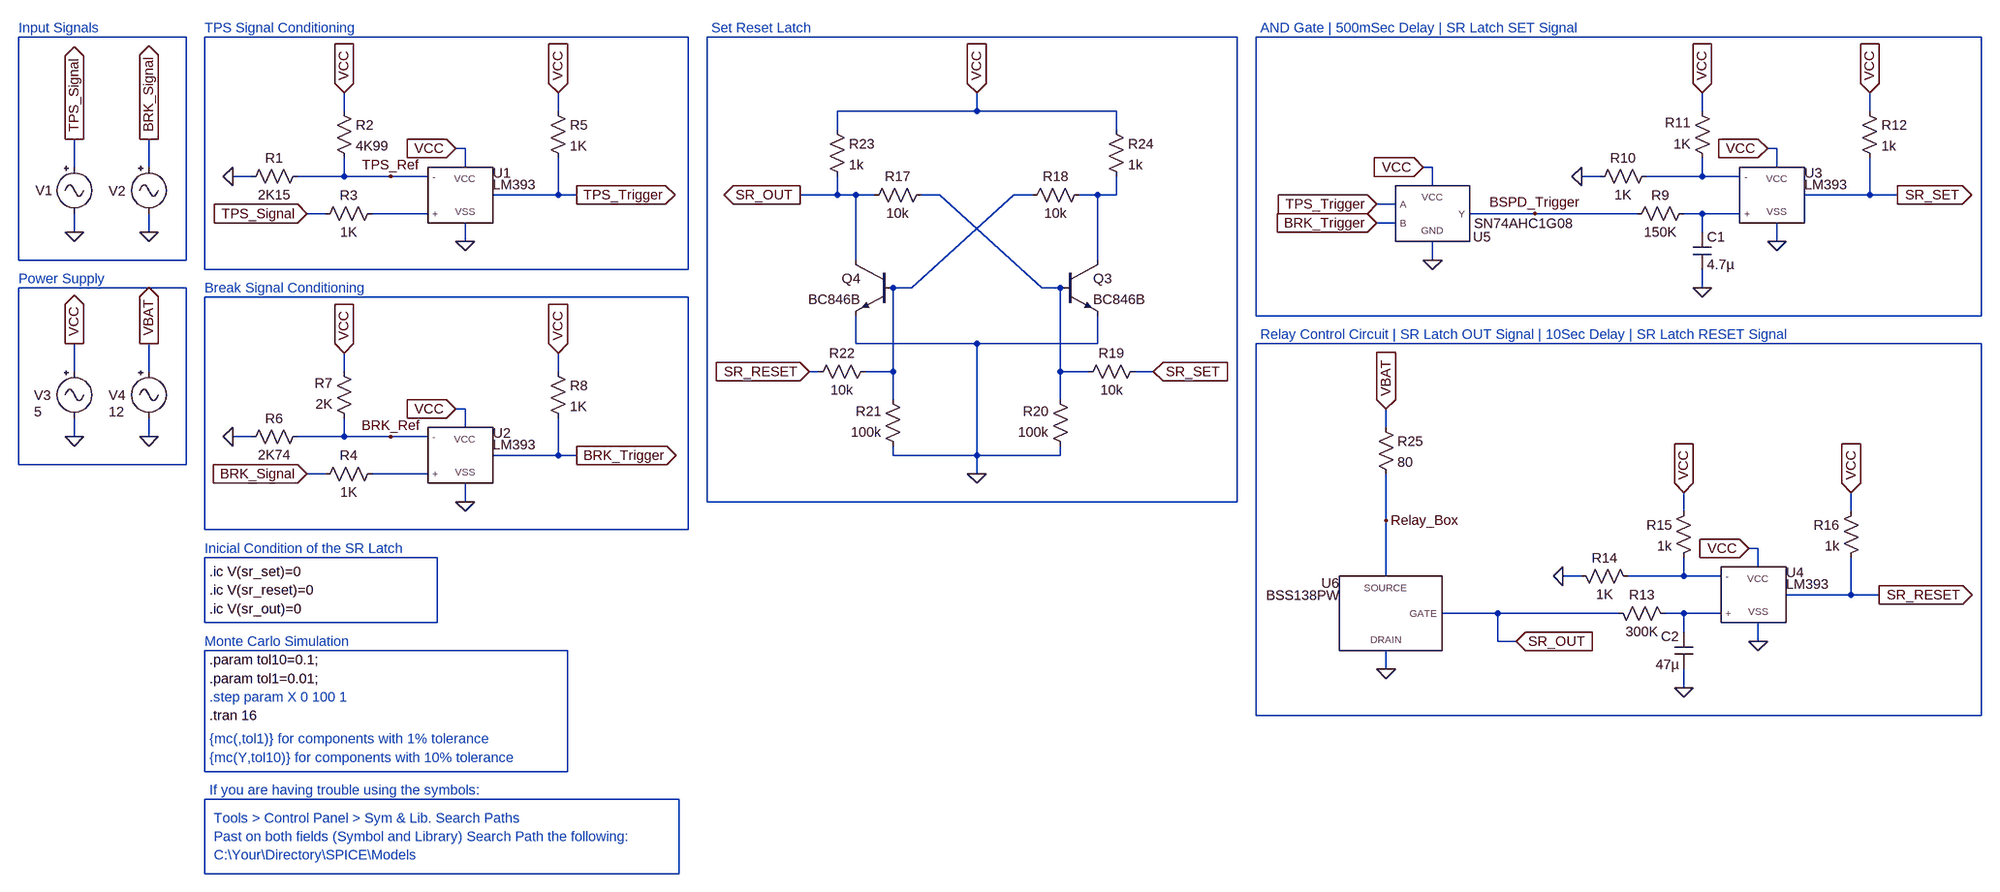
[diagram p0: schematic BSPD.asc]
BSPD.asc, the LTspice schematic file:
Version 4
SHEET 1 4868 2392
WIRE -1392 -240 -1680 -240
WIRE -528 -240 -1360 -240
WIRE 416 -240 -496 -240
WIRE 1696 -240 448 -240
WIRE -1120 -112 -1120 -144
WIRE -752 -112 -752 -144
WIRE -32 -112 -32 -144
WIRE -32 -112 -272 -112
WIRE 208 -112 -32 -112
WIRE 1216 -112 1216 -144
WIRE 1504 -112 1504 -144
WIRE -272 -80 -272 -112
WIRE 208 -80 208 -112
WIRE -912 -48 -928 -48
WIRE 1344 -48 1328 -48
WIRE -1584 -16 -1584 -64
WIRE -1456 -16 -1456 -64
WIRE -912 -16 -912 -48
WIRE 752 -16 736 -16
WIRE 1344 -16 1344 -48
WIRE -1280 0 -1312 0
WIRE -1120 0 -1120 -32
WIRE -1120 0 -1200 0
WIRE -1040 0 -1120 0
WIRE -976 0 -1040 0
WIRE 1040 0 1008 0
WIRE 1216 0 1216 -32
WIRE 1216 0 1120 0
WIRE 1280 0 1216 0
WIRE 752 16 752 -16
WIRE -752 32 -752 -32
WIRE -752 32 -864 32
WIRE -720 32 -752 32
WIRE -272 32 -272 0
WIRE -272 32 -336 32
WIRE -240 32 -272 32
WIRE -208 32 -240 32
WIRE -96 32 -128 32
WIRE 64 32 32 32
WIRE 176 32 144 32
WIRE 208 32 208 0
WIRE 208 32 176 32
WIRE 1504 32 1504 -32
WIRE 1504 32 1392 32
WIRE 1552 32 1504 32
WIRE 688 48 656 48
WIRE -1152 64 -1184 64
WIRE -976 64 -1072 64
WIRE 928 64 816 64
WIRE 1104 64 928 64
WIRE 1216 64 1184 64
WIRE 1280 64 1216 64
WIRE 688 80 656 80
WIRE -1584 96 -1584 64
WIRE -1456 96 -1456 64
WIRE 1216 96 1216 64
WIRE -912 112 -912 80
WIRE 1344 112 1344 80
WIRE -1680 144 -1680 -240
WIRE -1392 144 -1392 -240
WIRE -1392 144 -1680 144
WIRE -240 144 -240 32
WIRE 176 144 176 32
WIRE 752 144 752 112
WIRE -1360 160 -1360 -240
WIRE -528 160 -528 -240
WIRE -528 160 -1360 160
WIRE -1392 192 -1680 192
WIRE -144 192 32 32
WIRE -144 192 -176 192
WIRE 80 192 -96 32
WIRE 112 192 80 192
WIRE 1216 192 1216 160
WIRE -528 208 -1360 208
WIRE 448 240 448 -240
WIRE 1696 240 1696 -240
WIRE 1696 240 448 240
WIRE -240 288 -240 240
WIRE -32 288 -240 288
WIRE 176 288 176 240
WIRE 176 288 -32 288
WIRE 1696 288 448 288
WIRE -1584 336 -1584 288
WIRE -1456 336 -1456 288
WIRE -1120 336 -1120 304
WIRE -752 336 -752 304
WIRE -304 336 -320 336
WIRE -176 336 -176 192
WIRE -176 336 -224 336
WIRE 112 336 112 192
WIRE 160 336 112 336
WIRE 272 336 240 336
WIRE -176 384 -176 336
WIRE 112 384 112 336
WIRE -912 400 -928 400
WIRE -912 432 -912 400
WIRE 672 432 672 400
WIRE -1584 448 -1584 416
WIRE -1456 448 -1456 416
WIRE -1280 448 -1312 448
WIRE -1120 448 -1120 416
WIRE -1120 448 -1200 448
WIRE -1040 448 -1120 448
WIRE -976 448 -1040 448
WIRE -752 480 -752 416
WIRE -752 480 -864 480
WIRE -720 480 -752 480
WIRE -176 480 -176 464
WIRE -32 480 -32 288
WIRE -32 480 -176 480
WIRE 112 480 112 464
WIRE 112 480 -32 480
WIRE -1680 496 -1680 192
WIRE -1392 496 -1392 192
WIRE -1392 496 -1680 496
WIRE -1152 512 -1184 512
WIRE -976 512 -1072 512
WIRE -32 512 -32 480
WIRE -912 560 -912 528
WIRE -496 560 -496 -240
WIRE 416 560 416 -240
WIRE 416 560 -496 560
WIRE 1184 576 1184 544
WIRE 1472 576 1472 544
WIRE 672 592 672 512
WIRE -1360 608 -1360 208
WIRE -528 608 -528 208
WIRE -528 608 -1360 608
WIRE 1312 640 1296 640
WIRE -960 656 -1360 656
WIRE 1312 672 1312 640
WIRE 672 688 672 592
WIRE 1008 688 976 688
WIRE 1184 688 1184 656
WIRE 1184 688 1088 688
WIRE 1248 688 1184 688
WIRE 1472 720 1472 656
WIRE 1472 720 1360 720
WIRE 1520 720 1472 720
WIRE 864 752 768 752
WIRE 1072 752 864 752
WIRE 1184 752 1152 752
WIRE 1248 752 1184 752
WIRE -1360 768 -1360 656
WIRE -960 768 -960 656
WIRE -960 768 -1360 768
WIRE 1184 784 1184 752
WIRE 864 800 864 752
WIRE 896 800 864 800
WIRE 1312 800 1312 768
WIRE -736 816 -1360 816
WIRE 672 848 672 816
WIRE 1184 880 1184 848
WIRE 448 928 448 288
WIRE 1696 928 1696 288
WIRE 1696 928 448 928
WIRE -1360 1024 -1360 816
WIRE -736 1024 -736 816
WIRE -736 1024 -1360 1024
WIRE -544 1072 -1360 1072
WIRE -1360 1200 -1360 1072
WIRE -544 1200 -544 1072
WIRE -544 1200 -1360 1200
FLAG -720 32 TPS_Trigger
IOPIN -720 32 Out
FLAG 1552 32 SR_SET
IOPIN 1552 32 Out
FLAG -336 32 SR_OUT
IOPIN -336 32 Out
FLAG 272 336 SR_SET
IOPIN 272 336 In
FLAG -320 336 SR_RESET
IOPIN -320 336 In
FLAG 1520 720 SR_RESET
IOPIN 1520 720 Out
FLAG 672 592 Relay_Box
FLAG -1040 448 BRK_Ref
FLAG -1584 -64 TPS_Signal
IOPIN -1584 -64 Out
FLAG -1584 96 0
FLAG -1456 96 0
FLAG -1456 -64 BRK_Signal
IOPIN -1456 -64 Out
FLAG -1584 448 0
FLAG -1584 288 VCC
IOPIN -1584 288 Out
FLAG -1456 448 0
FLAG -1456 288 VBAT
IOPIN -1456 288 Out
FLAG -1120 -144 VCC
IOPIN -1120 -144 In
FLAG -1184 64 TPS_Signal
IOPIN -1184 64 In
FLAG -928 -48 VCC
IOPIN -928 -48 In
FLAG -752 -144 VCC
IOPIN -752 -144 In
FLAG -1312 0 0
FLAG -928 400 VCC
IOPIN -928 400 In
FLAG -752 304 VCC
IOPIN -752 304 In
FLAG -1312 448 0
FLAG -1120 304 VCC
IOPIN -1120 304 In
FLAG -1184 512 BRK_Signal
IOPIN -1184 512 In
FLAG -1040 0 TPS_Ref
FLAG -720 480 BRK_Trigger
IOPIN -720 480 Out
FLAG 656 48 TPS_Trigger
IOPIN 656 48 In
FLAG 656 80 BRK_Trigger
IOPIN 656 80 In
FLAG 752 144 0
FLAG 736 -16 VCC
IOPIN 736 -16 In
FLAG 928 64 BSPD_Trigger
FLAG 1216 192 0
FLAG 1008 0 0
FLAG 1216 -144 VCC
IOPIN 1216 -144 In
FLAG 1328 -48 VCC
IOPIN 1328 -48 In
FLAG 1504 -144 VCC
IOPIN 1504 -144 In
FLAG -32 -144 VCC
IOPIN -32 -144 In
FLAG -32 512 0
FLAG 976 688 0
FLAG 1184 544 VCC
IOPIN 1184 544 In
FLAG 1184 880 0
FLAG -912 112 0
FLAG -912 560 0
FLAG 1344 112 0
FLAG 672 848 0
FLAG 1312 800 0
FLAG 1296 640 VCC
IOPIN 1296 640 In
FLAG 1472 544 VCC
IOPIN 1472 544 In
FLAG 672 400 VBAT
IOPIN 672 400 In
FLAG 896 800 SR_OUT
IOPIN 896 800 In
SYMBOL res -1136 -128 R0
SYMATTR InstName R2
SYMATTR Value 4K99
SYMBOL res -1184 -16 R90
WINDOW 0 0 56 VBottom 2
WINDOW 3 32 56 VTop 2
SYMATTR InstName R1
SYMATTR Value 2K15
SYMBOL res -1056 48 R90
WINDOW 0 0 56 VBottom 2
WINDOW 3 32 56 VTop 2
SYMATTR InstName R3
SYMATTR Value 1K
SYMBOL Misc\\signal -1584 -32 R0
WINDOW 0 -67 56 Left 2
WINDOW 123 0 0 Left 0
WINDOW 39 0 0 Left 0
WINDOW 3 -167 97 Invisible 2
SYMATTR InstName V1
SYMATTR Value PWL(1 0 1.01 4 2 4 2.01 0 3 0 3.01 4 4 4 4.01 0)
SYMBOL res -1056 496 R90
WINDOW 0 0 56 VBottom 2
WINDOW 3 32 56 VTop 2
SYMATTR InstName R4
SYMATTR Value 1K
SYMBOL res -768 -128 R0
SYMATTR InstName R5
SYMATTR Value 1K
SYMBOL Misc\\signal -1456 -32 R0
WINDOW 0 -69 57 Left 2
WINDOW 123 0 0 Left 0
WINDOW 39 0 0 Left 0
WINDOW 3 24 104 Invisible 2
SYMATTR InstName V2
SYMATTR Value PWL(2 0 2.01 3.5)
SYMBOL res -1184 432 R90
WINDOW 0 0 56 VBottom 2
WINDOW 3 32 56 VTop 2
SYMATTR InstName R6
SYMATTR Value 2K74
SYMBOL res -1104 432 R180
WINDOW 0 36 76 Left 2
WINDOW 3 36 40 Left 2
SYMATTR InstName R7
SYMATTR Value 2K
SYMBOL res -768 320 R0
SYMATTR InstName R8
SYMATTR Value 1K
SYMBOL res 1200 48 R90
WINDOW 0 0 56 VBottom 2
WINDOW 3 32 56 VTop 2
SYMATTR InstName R9
SYMATTR Value 150K
SYMBOL cap 1200 96 R0
SYMATTR InstName C1
SYMATTR Value 4.7µ
SYMBOL res 1136 -16 R90
WINDOW 0 0 56 VBottom 2
WINDOW 3 32 56 VTop 2
SYMATTR InstName R10
SYMATTR Value 1K
SYMBOL res 1232 -16 R180
WINDOW 0 36 76 Left 2
WINDOW 3 36 40 Left 2
SYMATTR InstName R11
SYMATTR Value 1K
SYMBOL res 1488 -128 R0
SYMATTR InstName R12
SYMATTR Value 1k
SYMBOL npn 112 144 R0
SYMATTR InstName Q3
SYMATTR Value BC846B
SYMBOL npn -176 144 M0
SYMATTR InstName Q4
SYMATTR Value BC846B
SYMBOL res -112 16 R90
WINDOW 0 0 56 VBottom 2
WINDOW 3 32 56 VTop 2
SYMATTR InstName R17
SYMATTR Value 10k
SYMBOL res 160 16 R90
WINDOW 0 0 56 VBottom 2
WINDOW 3 32 56 VTop 2
SYMATTR InstName R18
SYMATTR Value 10k
SYMBOL res 256 320 R90
WINDOW 0 0 56 VBottom 2
WINDOW 3 32 56 VTop 2
SYMATTR InstName R19
SYMATTR Value 10k
SYMBOL res 128 480 R180
WINDOW 0 36 76 Left 2
WINDOW 3 36 40 Left 2
SYMATTR InstName R20
SYMATTR Value 100k
SYMBOL res -160 480 R180
WINDOW 0 36 76 Left 2
WINDOW 3 36 40 Left 2
SYMATTR InstName R21
SYMATTR Value 100k
SYMBOL res -320 352 R270
WINDOW 0 32 56 VTop 2
WINDOW 3 0 56 VBottom 2
SYMATTR InstName R22
SYMATTR Value 10k
SYMBOL res -288 -96 R0
SYMATTR InstName R23
SYMATTR Value 1k
SYMBOL res 192 -96 R0
SYMATTR InstName R24
SYMATTR Value 1k
SYMBOL res 1056 736 M90
WINDOW 0 0 56 VBottom 2
WINDOW 3 32 56 VTop 2
SYMATTR InstName R13
SYMATTR Value 300K
SYMBOL cap 1200 784 M0
SYMATTR InstName C2
SYMATTR Value 47µ
SYMBOL res 1488 560 M0
SYMATTR InstName R16
SYMATTR Value 1k
SYMBOL res 1104 704 M270
WINDOW 0 32 56 VTop 2
WINDOW 3 0 56 VBottom 2
SYMATTR InstName R14
SYMATTR Value 1K
SYMBOL res 1200 560 M0
SYMATTR InstName R15
SYMATTR Value 1k
SYMBOL res 656 416 R0
SYMATTR InstName R25
SYMATTR Value 80
SYMBOL Misc\\signal -1584 320 R0
WINDOW 0 -69 57 Left 2
WINDOW 123 0 0 Left 0
WINDOW 39 0 0 Left 0
WINDOW 3 -69 85 Left 2
SYMATTR InstName V3
SYMATTR Value 5
SYMBOL Misc\\signal -1456 320 R0
WINDOW 0 -69 57 Left 2
WINDOW 123 0 0 Left 0
WINDOW 39 0 0 Left 0
WINDOW 3 -69 85 Left 2
SYMATTR InstName V4
SYMATTR Value 12
SYMBOL LM393 -944 32 R0
SYMATTR InstName U1
SYMBOL LM393 -944 480 R0
SYMATTR InstName U2
SYMBOL LM393 1312 32 R0
SYMATTR InstName U3
SYMBOL LM393 1280 720 R0
SYMATTR InstName U4
SYMBOL SN74AHC1G08 736 64 R0
WINDOW 0 86 40 Left 2
WINDOW 3 87 17 Left 2
SYMATTR InstName U5
SYMBOL BSS138PW 672 752 M0
SYMATTR InstName U6
TEXT -1352 928 Left 2 !.tran 16
TEXT -1352 680 Left 2 !.ic V(sr_set)=0
TEXT -1680 -256 Left 2 ;Input Signals
TEXT -1680 176 Left 2 ;Power Supply
TEXT -1360 -256 Left 2 ;TPS Signal Conditioning
TEXT -1360 192 Left 2 ;Break Signal Conditioning
TEXT 456 -256 Left 2 ;AND Gate | 500mSec Delay | SR Latch SET Signal
TEXT -1344 1168 Left 2 ;C:\\Your\\Directory\\SPICE\\Models
TEXT -488 -256 Left 2 ;Set Reset Latch
TEXT 456 272 Left 2 ;Relay Control Circuit | SR Latch OUT Signal | 10Sec Delay | SR Latch RESET Signal
TEXT -1352 1056 Left 2 ;If you are having trouble using the symbols:
TEXT -1344 1104 Left 2 ;Tools > Control Panel > Sym & Lib. Search Paths
TEXT -1344 1136 Left 2 ;Past on both fields (Symbol and Library) Search Path the following:
TEXT -1360 800 Left 2 ;Monte Carlo Simulation
TEXT -1352 832 Left 2 !.param tol10=0.1;
TEXT -1352 864 Left 2 !.param tol1=0.01;
TEXT -1352 712 Left 2 !.ic V(sr_reset)=0
TEXT -1352 744 Left 2 !.ic V(sr_out)=0
TEXT -1360 640 Left 2 ;Inicial Condition of the SR Latch
TEXT -1352 896 Left 2 ;.step param X 0 100 1
TEXT -1352 968 Left 2 ;{mc(,tol1)} for components with 1% tolerance
TEXT -1352 1000 Left 2 ;{mc(Y,tol10)} for components with 10% tolerance

The netlist it stands for:
* BSPD.asc
R2 VCC TPS_Ref 4K99
R1 TPS_Ref 0 2K15
R3 N009 TPS_Signal 1K
V1 TPS_Signal 0 PWL(1 0 1.01 4 2 4 2.01 0 3 0 3.01 4 4 4 4.01 0)
R4 N014 BRK_Signal 1K
R5 VCC TPS_Trigger 1K
V2 BRK_Signal 0 PWL(2 0 2.01 3.5)
R6 BRK_Ref 0 2K74
R7 BRK_Ref VCC 2K
R8 VCC BRK_Trigger 1K
R9 N010 BSPD_Trigger 150K
C1 N010 0 4.7µ
R10 N005 0 1K
R11 N005 VCC 1K
R12 VCC SR_SET 1k
Q3 N008 N006 0 0 BC846B
Q4 SR_OUT N007 0 0 BC846B
R17 N006 SR_OUT 10k
R18 N008 N007 10k
R19 SR_SET N006 10k
R20 0 N006 100k
R21 0 N007 100k
R22 SR_RESET N007 10k
R23 VCC SR_OUT 1k
R24 VCC N008 1k
R13 SR_OUT N017 300K
C2 N017 0 47µ
R16 VCC SR_RESET 1k
R14 N016 0 1K
R15 VCC N016 1k
R25 VBAT Relay_Box 80
V3 VCC 0 5
V4 VBAT 0 12
XU1 N009 TPS_Ref VCC 0 TPS_Trigger LM393  ; pins + - VCC VSS ?
XU2 N014 BRK_Ref VCC 0 BRK_Trigger LM393  ; pins + - VCC VSS ?
XU3 N010 N005 VCC 0 SR_SET LM393  ; pins + - VCC VSS ?
XU4 N017 N016 VCC 0 SR_RESET LM393  ; pins + - VCC VSS ?
XU5 BSPD_Trigger TPS_Trigger BRK_Trigger VCC 0 SN74AHC1G08  ; pins Y A B VCC GND
XU6 0 SR_OUT Relay_Box BSS138PW  ; pins DRAIN GATE SOURCE
.model NPN NPN
.model PNP PNP
.lib standard.bjt
.tran 16
.ic V(sr_set)=0
* Input Signals
* Power Supply
* TPS Signal Conditioning
* Break Signal Conditioning
* AND Gate | 500mSec Delay | SR Latch SET Signal
* C:\Your\Directory\SPICE\Models
* Set Reset Latch
* Relay Control Circuit | SR Latch OUT Signal | 10Sec Delay | SR Latch RESET Signal
* If you are having trouble using the symbols:
* Tools > Control Panel > Sym & Lib. Search Paths
* Past on both fields (Symbol and Library) Search Path the following:
* Monte Carlo Simulation
.param tol10=0.1;
.param tol1=0.01;
.ic V(sr_reset)=0
.ic V(sr_out)=0
* Inicial Condition of the SR Latch
* .step param X 0 100 1
* {mc(,tol1)} for components with 1% tolerance
* {mc(Y,tol10)} for components with 10% tolerance
.lib C:\Users\35196\Desktop\FS\BPSD\SPICE\Models\LM393.lib
.lib C:\Users\35196\Desktop\FS\BPSD\SPICE\Models\SN74AHC1G08.lib
.lib C:\Users\35196\Desktop\FS\BPSD\SPICE\Models\BSS138PW_8_19_2010.lib
.backanno
.end